# Altium schematic sheet main.SchDoc
size 209 x 297 mm; Address1: Address1; Address2: Address2; Address3: Address3; Address4: Address4; SheetNumber: 1; SheetTotal: 1; Scale: 1:1; Разраб.: Михаил Каа; Обозначение документа: МГТФ.001 Э3; Пров.: no check; Утв.: chat; Номер листа: 1; Общее количество листов: 1; Наименование организации: Михаил Каа; Перв. применение: МГТФ.001; Наименование изделия 1: МГТФ; Наименование изделия 2: Схема электрическая; Наименование изделия 3: принципиальная; Нач. отд.: Нач. отд.; Фамилия нач. отд.: chat
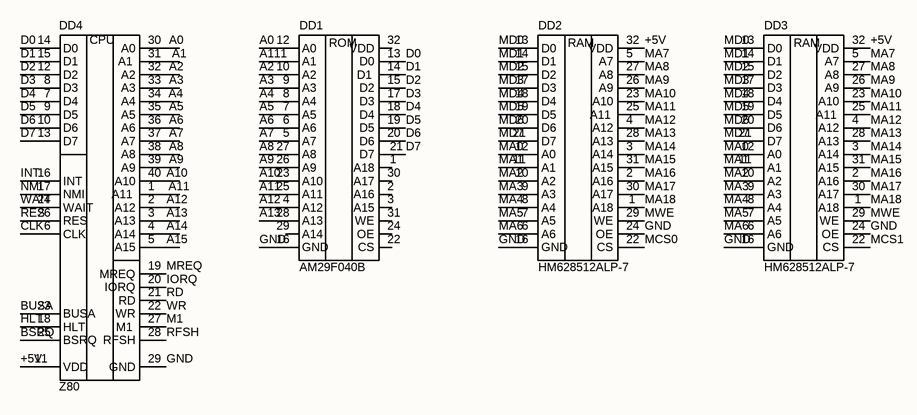
[diagram p0: main.SchDoc]

## Parts
DD1  AM29F040B  [DIP254P1524X482-32]
DD2  HM628512ALP-7  [DIP254P1524X482-32]
DD3  HM628512ALP-7  [DIP254P1524X482-32]
DD4  Z80  [DIP1540W47P254L5320H635Q40B]

## Nets
+5V: DD2.32(VDD) DD3.32(VDD) DD4.11(VDD)
A0: DD1.12(A0) DD4.30(A0)
A1: DD1.11(A1) DD4.31(A1)
A2: DD1.10(A2) DD4.32(A2)
A3: DD1.9(A3) DD4.33(A3)
A4: DD1.8(A4) DD4.34(A4)
A5: DD1.7(A5) DD4.35(A5)
A6: DD1.6(A6) DD4.36(A6)
A7: DD1.5(A7) DD4.37(A7)
A8: DD1.27(A8) DD4.38(A8)
A9: DD1.26(A9) DD4.39(A9)
A10: DD1.23(A10) DD4.40(A10)
A11: DD1.25(A11) DD4.1(A11)
A12: DD1.4(A12) DD4.2(A12)
A13: DD1.28(A13) DD4.3(A13)
A14: DD4.4(A14)
A15: DD4.5(A15)
BSRQ: DD4.25(BSRQ)
BUSA: DD4.23(BUSA)
CLK: DD4.6(CLK)
D0: DD1.13(D0) DD4.14(D0)
D1: DD1.14(D1) DD4.15(D1)
D2: DD1.15(D2) DD4.12(D2)
D3: DD1.17(D3) DD4.8(D3)
D4: DD1.18(D4) DD4.7(D4)
D5: DD1.19(D5) DD4.9(D5)
D6: DD1.20(D6) DD4.10(D6)
D7: DD1.21(D7) DD4.13(D7)
GND: DD1.16(GND) DD2.16(GND) DD2.24(OE) DD3.16(GND) DD3.24(OE) DD4.29(GND)
HLT: DD4.18(HLT)
INT: DD4.16(INT)
IORQ: DD4.20(IORQ)
M1: DD4.27(M1)
MA0: DD2.12(A0) DD3.12(A0)
MA1: DD2.11(A1) DD3.11(A1)
MA2: DD2.10(A2) DD3.10(A2)
MA3: DD2.9(A3) DD3.9(A3)
MA4: DD2.8(A4) DD3.8(A4)
MA5: DD2.7(A5) DD3.7(A5)
MA6: DD2.6(A6) DD3.6(A6)
MA7: DD2.5(A7) DD3.5(A7)
MA8: DD2.27(A8) DD3.27(A8)
MA9: DD2.26(A9) DD3.26(A9)
MA10: DD2.23(A10) DD3.23(A10)
MA11: DD2.25(A11) DD3.25(A11)
MA12: DD2.4(A12) DD3.4(A12)
MA13: DD2.28(A13) DD3.28(A13)
MA14: DD2.3(A14) DD3.3(A14)
MA15: DD2.31(A15) DD3.31(A15)
MA16: DD2.2(A16) DD3.2(A16)
MA17: DD2.30(A17) DD3.30(A17)
MA18: DD2.1(A18) DD3.1(A18)
MCS0: DD2.22(CS)
MCS1: DD3.22(CS)
MD0: DD2.13(D0) DD3.13(D0)
MD1: DD2.14(D1) DD3.14(D1)
MD2: DD2.15(D2) DD3.15(D2)
MD3: DD2.17(D3) DD3.17(D3)
MD4: DD2.18(D4) DD3.18(D4)
MD5: DD2.19(D5) DD3.19(D5)
MD6: DD2.20(D6) DD3.20(D6)
MD7: DD2.21(D7) DD3.21(D7)
MREQ: DD4.19(MREQ)
MWE: DD2.29(WE) DD3.29(WE)
NMI: DD4.17(NMI)
RD: DD4.21(RD)
RES: DD4.26(RES)
RFSH: DD4.28(RFSH)
WAIT: DD4.24(WAIT)
WR: DD4.22(WR)

Not connected (* = marked no-connect by the designer): DD1 1(A18) 2(A16) 3(A15) 22(CS) 24(OE) 29(A14) 30(A17) 31(WE) 32(VDD)

## Notes on the sheet
- Перв. примен.
- Справ. №
- Подп. и дата
- Инв. № дубл.
- Взам. инв. №
- Разраб.
- Изм.
- Лист
- № докум.
- Подп.
- Дата
- Лит.
- Масса
- Масштаб
- Пров.
- Т.контр.
- Листов
- Инв. № подл.
- Утв.
- Н.контр.
- Копировал
- Формат А4
- (in symbol AM29F040B) ROM
- (in symbol HM628512ALP-7) RAM
- (in symbol Z80) CPU

## Library data of the parts
DD2 DD3 = HM628512ALP-7: 512Kx8 Static RAM